# Altium project UsbConBoard.PrjPcb
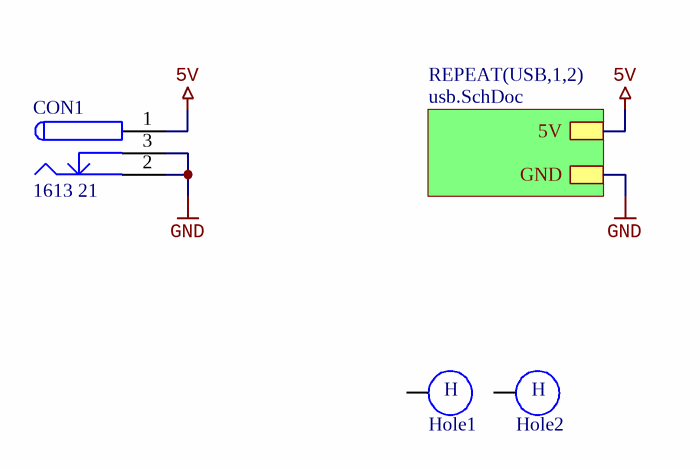
[diagram p0: top.SchDoc]
id: UsbConBoard; ver: 1
3 sheets, 29 parts. Net scope: strictly hierarchical (ports join the sheet entries above them; power ports are local).
Board file: UsbConBoard.PcbDoc
Sheets:
  top.SchDoc
    USB1 = usb.SchDoc
      CFGA = config.SchDoc
      CFGB = config.SchDoc
    USB2 = usb.SchDoc
      CFGA = config.SchDoc
      CFGB = config.SchDoc

## Sheet top.SchDoc: Test
size A4; Author: Łukasz Przeniosło; Organization: PRZENIOSLO; Address1: Electronics; Address2: &; Address3: Software; DocumentNumber: 1; Revision: 1.0; SheetNumber: 1; SheetTotal: 3

### Parts
CON1  1613 21  [JACK-2.5]
Hole1  Hole  [HOLE-6/3.2]  (value not drawn)
Hole2  Hole  [HOLE-6/3.2]  (value not drawn)

### Sub-sheets
REPEAT(USB,1,2) = usb.SchDoc: 5V, GND

### Nets
5V: CON1.1 ; sheet REPEAT(USB,1,2)/5V
GND: CON1.2 CON1.3 ; sheet REPEAT(USB,1,2)/GND

Not connected (* = marked no-connect by the designer): Hole1 1; Hole2 1

### Notes on the sheet
- Title:
- Date:
- Author:
- Project:
- Time:
- Sheet
- of
- File:
- (in symbol HOLE_) H

### Library data of the parts
CON1 = JACK-2.5: Low Voltage Power Supply Connector; manid: 1613 21
Hole1 Hole2 = HOLE_

## Sheet usb.SchDoc: Test
size A4; Author: Łukasz Przeniosło; Organization: PRZENIOSLO; Address1: Electronics; Address2: &; Address3: Software; DocumentNumber: 2; Revision: 1.0; SheetNumber: 2; SheetTotal: 3
Used 2 times, as channels USB1, USB2. Parts and nets are listed once, with the designators drawn on the sheet.
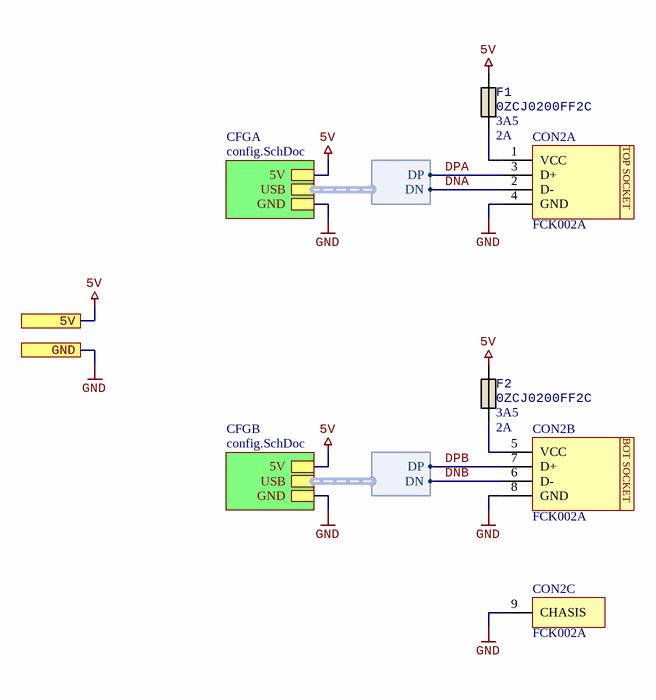
[diagram p1: usb.SchDoc]

### Parts
CON2  FCK002A  [USB-A-SOCKET-DOUBLE]  (parts A,B,C of 3)
F1  0ZCJ0200FF2C  I_trip: 3A5  I_nom: 2A  [FUSE_1206]
F2  0ZCJ0200FF2C  I_trip: 3A5  I_nom: 2A  [FUSE_1206]

### Sub-sheets
CFGA = config.SchDoc: USB (harness USB), 5V, GND
CFGB = config.SchDoc: USB (harness USB), 5V, GND

### Ports
5V, GND

### Harnesses
USB: DP, DN

### Nets
5V: F1.2 F2.2 ; port 5V, sheet CFGA/5V, sheet CFGB/5V
GND: CON2.4(GND) CON2.8(GND) CON2.9(CHASIS) ; port GND, sheet CFGA/GND, sheet CFGB/GND
DNA: CON2.2(D-) ; sheet CFGA/USB.DN
DNB: CON2.6(D-) ; sheet CFGB/USB.DN
DPA: CON2.3(D+) ; sheet CFGA/USB.DP
DPB: CON2.7(D+) ; sheet CFGB/USB.DP
NetCON2_1: CON2.1(VCC) F1.1
NetCON2_5: CON2.5(VCC) F2.1

### Channels
USB1: designators CON2=USB1CON2 F1=USB1F1 F2=USB1F2; ports 5V=5V GND=GND
USB2: designators CON2=USB2CON2 F1=USB2F1 F2=USB2F2; ports 5V=5V GND=GND

### Notes on the sheet
- Title:
- Date:
- Author:
- Project:
- Time:
- Sheet
- of
- File:
- (in symbol USB-A-Sock-Double, part A) TOP SOCKET
- (in symbol USB-A-Sock-Double, part B) BOT SOCKET

### Library data of the parts
CON2 = USB-A-Sock-Double: Dual USB A connector; manid: FCK002A
F1 F2 = PTC: PTC SMD Fuses; manid: 0ZCJ0200FF2C

## Sheet config.SchDoc: Test
size A4; Author: Łukasz Przeniosło; Organization: PRZENIOSLO; Address1: Electronics; Address2: &; Address3: Software; DocumentNumber: 3; Revision: 1.0; SheetNumber: 3; SheetTotal: 3
Used 4 times, as channels USB1/CFGA, USB1/CFGB, USB2/CFGA, USB2/CFGB. Parts and nets are listed once, with the designators drawn on the sheet.
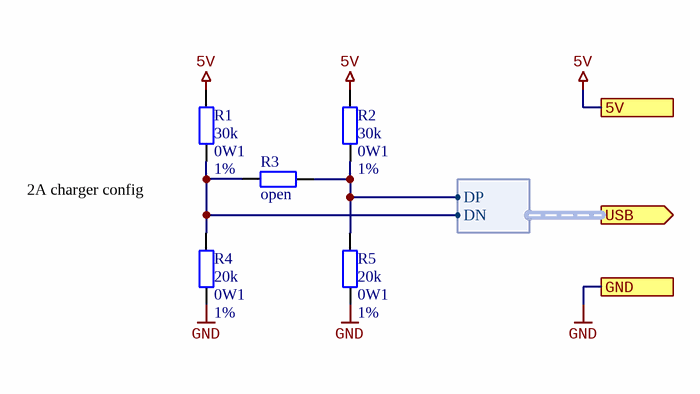
[diagram p2: config.SchDoc]

### Parts
R1  30k  Power: 0W1  Tolerance: 1%  [RESC1608N]
R2  30k  Power: 0W1  Tolerance: 1%  [RESC1608N]
R3  open  [RESC1608N]
R4  20k  Power: 0W1  Tolerance: 1%  [RESC1608N]
R5  20k  Power: 0W1  Tolerance: 1%  [RESC1608N]

### Ports
5V, GND, USB (out, harness USB)

### Harnesses
USB: DP, DN

### Nets
5V: R1.2 R2.2 ; port 5V
GND: R4.1 R5.1 ; port GND
NetR1_1: R1.1 R3.1 R4.2 ; port USB.DN
NetR2_1: R2.1 R3.2 R5.2 ; port USB.DP

### Channels
USB1/CFGA: designators R1=CFGA1R1 R2=CFGA1R2 R3=CFGA1R3 R4=CFGA1R4 R5=CFGA1R5; ports 5V=5V GND=GND
USB1/CFGB: designators R1=CFGB1R1 R2=CFGB1R2 R3=CFGB1R3 R4=CFGB1R4 R5=CFGB1R5; ports 5V=5V GND=GND
USB2/CFGA: designators R1=CFGA2R1 R2=CFGA2R2 R3=CFGA2R3 R4=CFGA2R4 R5=CFGA2R5; ports 5V=5V GND=GND
USB2/CFGB: designators R1=CFGB2R1 R2=CFGB2R2 R3=CFGB2R3 R4=CFGB2R4 R5=CFGB2R5; ports 5V=5V GND=GND

### Notes on the sheet
- 2A charger config
- Title:
- Date:
- Author:
- Project:
- Time:
- Sheet
- of
- File:

### Library data of the parts
R1 R2 R4 R5 = Resistor
  R1 R2: Value: 30k
  R4 R5: Value: 20k
R3 = Resistor: Tolerance: 5%; Power: 0W; Value: open

## Nets that join several sheets
5V: top (CON1.1), USB1 (USB1F1.2 USB1F2.2), USB1/CFGA (CFGA1R1.2 CFGA1R2.2), USB1/CFGB (CFGB1R1.2 CFGB1R2.2), USB2 (USB2F1.2 USB2F2.2), USB2/CFGA (CFGA2R1.2 CFGA2R2.2), USB2/CFGB (CFGB2R1.2 CFGB2R2.2)
GND: top (CON1.2 CON1.3), USB1 (USB1CON2.4 USB1CON2.8 USB1CON2.9), USB1/CFGA (CFGA1R4.1 CFGA1R5.1), USB1/CFGB (CFGB1R4.1 CFGB1R5.1), USB2 (USB2CON2.4 USB2CON2.8 USB2CON2.9), USB2/CFGA (CFGA2R4.1 CFGA2R5.1), USB2/CFGB (CFGB2R4.1 CFGB2R5.1)
DNA_USB1: USB1 (USB1CON2.2), USB1/CFGA (CFGA1R1.1 CFGA1R3.1 CFGA1R4.2)
DNA_USB2: USB2 (USB2CON2.2), USB2/CFGA (CFGA2R1.1 CFGA2R3.1 CFGA2R4.2)
DNB_USB1: USB1 (USB1CON2.6), USB1/CFGB (CFGB1R1.1 CFGB1R3.1 CFGB1R4.2)
DNB_USB2: USB2 (USB2CON2.6), USB2/CFGB (CFGB2R1.1 CFGB2R3.1 CFGB2R4.2)
DPA_USB1: USB1 (USB1CON2.3), USB1/CFGA (CFGA1R2.1 CFGA1R3.2 CFGA1R5.2)
DPA_USB2: USB2 (USB2CON2.3), USB2/CFGA (CFGA2R2.1 CFGA2R3.2 CFGA2R5.2)
DPB_USB1: USB1 (USB1CON2.7), USB1/CFGB (CFGB1R2.1 CFGB1R3.2 CFGB1R5.2)
DPB_USB2: USB2 (USB2CON2.7), USB2/CFGB (CFGB2R2.1 CFGB2R3.2 CFGB2R5.2)